# Altium schematic sheet Pi_Power.SchDoc: =DocumentName
size B; DrawnBy: Cary Smith; Organization: Las Cumbres Observatoy; Address1: 6740 Cortona Dr.; Address2: Suite 102; Address3: Goleta, CA 93117; DocumentNumber: 1; Revision: 1; SheetNumber: 1; SheetTotal: 1000's
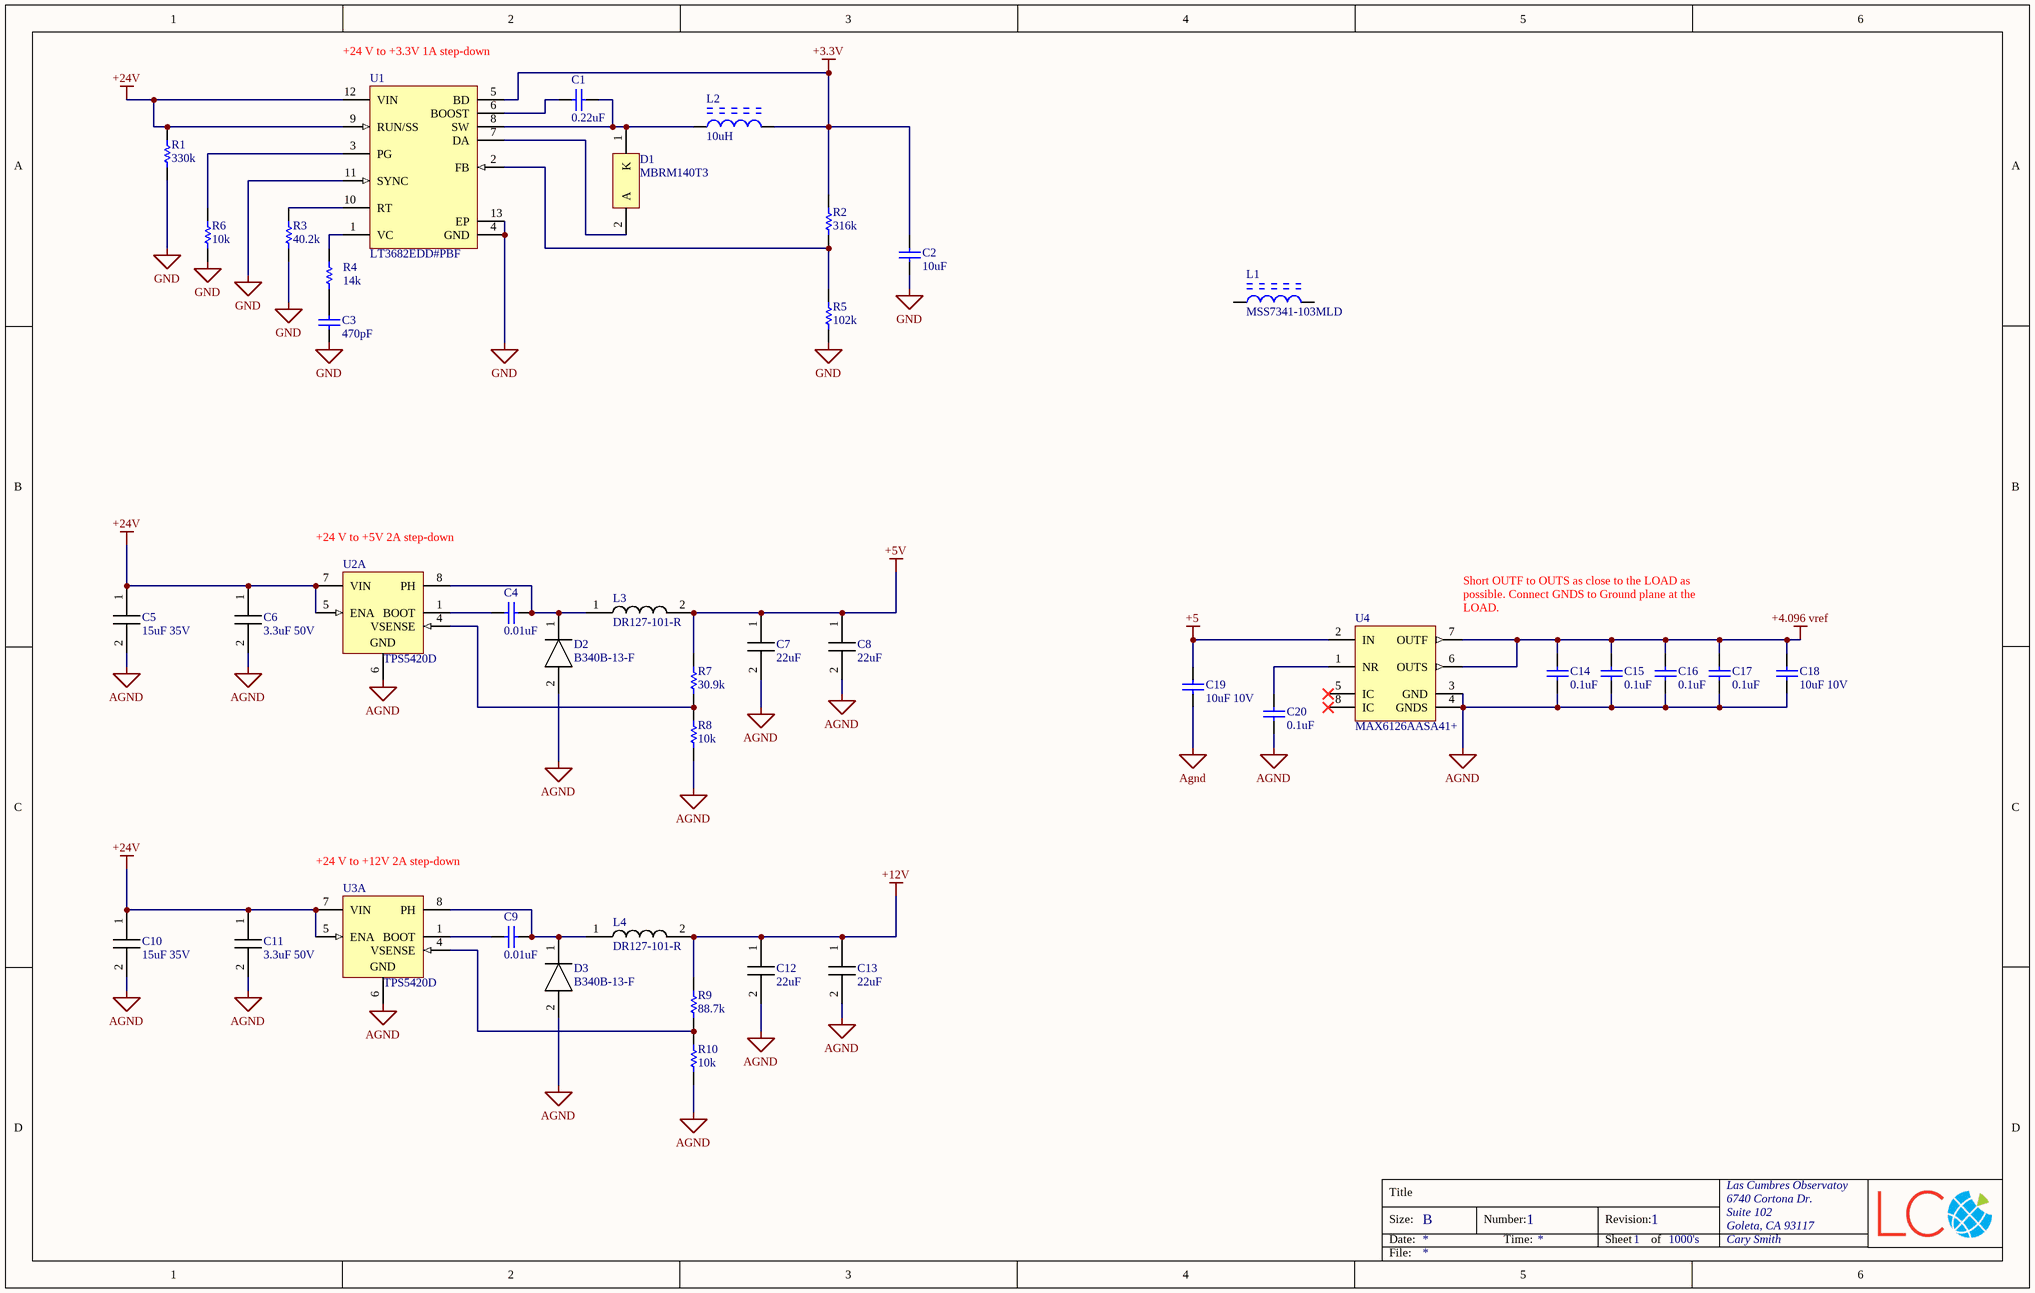
[diagram p0: Pi_Power.SchDoc]

## Parts
C1  0.22uF  [CAPC1608X90X35NL15T15]
C2  10uF  [CAPC2013X145X50NL20T25]
C3  470pF  [CAPC1005X55X25ML05T10]
C4  0.01uF  [CAPC1608X90X35LL15T15]
C5  15uF 35V  [CAPPM7343X310N]
C6  3.3uF 50V  [CAPC3225X230N]
C7  22uF  [CAPC3216X180N]
C8  22uF  [CAPC3216X180N]
C9  0.01uF  [CAPC1608X90X35LL15T15]
C10  15uF 35V  [CAPPM7343X310N]
C11  3.3uF 50V  [CAPC3225X230N]
C12  22uF  [CAPC3216X180N]
C13  22uF  [CAPC3216X180N]
C14  0.1uF  [CAPC1005X55X25ML05T10]
C15  0.1uF  [CAPC1005X55X25ML05T10]
C16  0.1uF  [CAPC1005X55X25ML05T10]
C17  0.1uF  [CAPC1005X55X25ML05T10]
C18  10uF 10V  [CAPC1609X100X15LL20]
C19  10uF 10V  [CAPC1609X100X15LL20]
C20  0.1uF  [CAPC1005X55X25ML05T10]
D1  MBRM140T3  [ONSC-POWERMITE-2-457-04_D_V]
D2  B340B-13-F  [DIOM5336X250N]
D3  B340B-13-F  [DIOM5336X250N]
L1  MSS7341-103MLD  [COIL-MSS7341_V]
L2  10uH  [COIL-MSS7341_V]
L3  DR127-101-R  [INDM125125X800N]
L4  DR127-101-R  [INDM125125X800N]
R1  330k  [RESC1005X40X25ML05T05]
R2  316k  [RESC1005X40X25LL05T05]
R3  40.2k  [RESC1005X40X25NL05T05]
R4  14k  [RESC1005X40X25LL05T05]
R5  102k  [RESC1005X40X25ML05T05]
R6  10k  [RESC1005X40X25NL05T05]
R7  30.9k  [RESC1005X40X25NL05T05]
R8  10k  [RESC1005X40X25NL05T05]
R9  88.7k  [RESC1005X40X25NL05T05]
R10  10k  [RESC1005X40X25NL05T05]
U1  LT3682EDD#PBF  [LT-DD-12_V]
U2  TPS5420D  [D0008A_L]  (part A of 2)
U3  TPS5420D  [D0008A_L]  (part A of 2)
U4  MAX6126AASA41+  [MAXM-S8+4_M]

## Nets
+3.3V: C2.2 L2.2 R2.2 U1.5(BD)
+4.096 vref: C14.2 C15.2 C16.2 C17.2 C18.2 U4.6(OUTS) U4.7(OUTF)
+5: C19.2 U4.2(IN)
+5V: C7.1 C8.1 L3.2 R7.2
+12V: C12.1 C13.1 L4.2 R9.2
+24V: C5.1(+) C6.1 C10.1(+) C11.1 R1.2 U1.9(RUN/SS) U1.12(VIN) U2.5(ENA) U2.7(VIN) U3.5(ENA) U3.7(VIN)
AGND: C5.2(-) C6.2 C7.2 C8.2 C10.2(-) C11.2 C12.2 C13.2 C14.1 C15.1 C16.1 C17.1 C18.1 C19.1 C20.1 D2.2(A) D3.2(A) R8.1 R10.1 U2.6(GND) U3.6(GND) U4.3(GND) U4.4(GNDS)
GND: C2.1 C3.1 R1.1 R3.1 R5.1 R6.1 U1.4(GND) U1.11(SYNC) U1.13(EP)
NetC1_1: C1.1 D1.1(K) L2.1 U1.8(SW)
NetC1_2: C1.2 U1.6(BOOST)
NetC3_2: C3.2 R4.1
NetC4_1: C4.1 U2.1(BOOT)
NetC4_2: C4.2 D2.1(K) L3.1 U2.8(PH)
NetC9_1: C9.1 U3.1(BOOT)
NetC9_2: C9.2 D3.1(K) L4.1 U3.8(PH)
NetC20_2: C20.2 U4.1(NR)
NetD1_2: D1.2(A) U1.7(DA)
NetR2_1: R2.1 R5.2 U1.2(FB)
NetR3_2: R3.2 U1.10(RT)
NetR4_2: R4.2 U1.1(VC)
NetR6_2: R6.2 U1.3(PG)
NetR7_1: R7.1 R8.2 U2.4(VSENSE)
NetR9_1: R9.1 R10.2 U3.4(VSENSE)

Not connected (* = marked no-connect by the designer): L1 1 2; U4 5(IC)* 8(IC)*

## Notes on the sheet
- (near U1) +24 V to +3.3V 1A step-down
- (near U2) +24 V to +5V 2A step-down
- Short OUTF to OUTS as close to the LOAD as possible. Connect GNDS to Ground plane at the LOAD.
- (near U3) +24 V to +12V 2A step-down
- Title
- Size:
- Date:
- B
- Number:
- Time:
- Revision:
- Sheet
- of
- File:

## Library data of the parts
C1 = CMP-2006-04195-1: 06033D224KAT2A; Manufacturer: AVX Interconnect / Elco; Part Number: 06033D224KAT2A
C2 = CMP-2007-01019-1: C0805C106M8PACTU; Manufacturer: Kemet; Part Number: C0805C106M8PACTU
C3 = CMP-2008-04369-1: GRM1555C1H471JA01D; Manufacturer: Murata; Part Number: GRM1555C1H471JA01D
C4 C9 = CMP-2006-04374-1: 06035C-103KAT2A; Manufacturer: AVX Interconnect / Elco; Part Number: 06035C-103KAT2A
C5 C10 = 293D156X9035D2TE3: Capacitor 293D156X9035D2TE3; Manufacturer_Name: Vishay; Allied_Number: 70398878; Datasheet Link: http://www.vishay.com/docs/40002/293d.pdf; Height: 3.1mm; Manufacturer_Part_Number: 293D156X9035D2TE3; Mouser Part Number: 74-293D156X9035D2TE3; Mouser Price/Stock: https://www.mouser.com/Search/Refine.aspx?Keyword=74-293D156X9035D2TE3; RS Part Number: 6843960; RS Price/Stock: http://uk.rs-online.com/web/p/tantalum-capacitors/6843960/?source=DS; Allied Price/Stock: https://www.alliedelec.com/vishay-dale-293d156x9035d2te3/70398878/
C6 C11 = C3225X7R1H335M250AB: Capacitor C3225X7R1H335M250AB; Manufacturer_Name: TDK; Datasheet Link: https://product.tdk.com/info/en/catalog/datasheets/mlcc_commercial_midvoltage_en.pdf; Height: 2.3mm; Manufacturer_Part_Number: C3225X7R1H335M250AB; RS Part Number: 9163037P; RS Price/Stock: http://uk.rs-online.com/web/p/products/9163037P
C7 C8 C12 C13 = C3216X6S1C226M160AC: Capacitor C3216X6S1C226M160AC; Manufacturer_Name: TDK; Datasheet Link: https://product.tdk.com/info/en/catalog/datasheets/mlcc_commercial_midvoltage_en.pdf; Height: 1.8mm; Manufacturer_Part_Number: C3216X6S1C226M160AC
C14-C17 C20 = CMP-2008-02013-1: VJ0402G104KXQCW1BC; Manufacturer: Vitramon; Part Number: VJ0402G104KXQCW1BC
C18 C19 = CMP-2006-00193-1: TACL106M010XTA; Manufacturer: AVX Interconnect / Elco; Part Number: TACL106M010XTA
D1 = CMP-1055-00287-1: Schottky Power Rectifier, 2-Pin Powermite, Tape and Reel; Manufacturer: On Semiconductor; Configuration: Single; IFSM Max (A): 50; ComponentLink3Description: Package Specification; Packing: Tape and Reel; RoHS: FALSE; ComponentLink1Description: Manufacturer URL; ComponentLink2URL: http://www.onsemi.cn/pub/Collateral/MBRM140-D.PDF; DatasheetVersion: Rev. 4; PartNumber: MBRM140T3; ComponentLink1URL: http://www.onsemi.com/; ComponentLink3URL: http://www.onsemi.com/pub_link/Collateral/457-04.PDF; PackageVersion: Rev. F, 05/2013; PackageDescription: 2-Pin POWERMITE, Body 1.965 x 1.9 mm; Mounting Technology: Surface Mount; ComponentLink2Description: Datasheet; PackageReference: POWERMITE-2-457-04
D2 D3 = B340B-13-F: Diode; Manufacturer_Name: Diodes Inc.; Datasheet Link: https://componentsearchengine.com/Datasheets/2/B340B-13-F.pdf; Height: 2.5mm; Manufacturer_Part_Number: B340B-13-F; Mouser Part Number: 621-B340B-F; Mouser Price/Stock: https://www.mouser.com/Search/Refine.aspx?Keyword=621-B340B-F; RS Part Number: 9228119; RS Price/Stock: http://uk.rs-online.com/web/p/products/9228119
L1 = CMP-2000-06766-1: Shielded Power Inductor, 10 uH, +/- 20%, 3.8 A, 2-Pin SMD, RoHS, Tape and Reel; Manufacturer: Coilcraft; Maximum DC Current: 3.8A; Test Frequency: 100kHz; Self Resonant Frequency: 32MHz; Maximum DC Resistance: 38mOhms; Core Material: Ferrite; Inductance: 10uH; Manufacturer URL: http://www.coilcraft.com/; Length: 7.3mm; Series: MSS7341; Product Category: FixedInductors; Product: PowerInductors; Datasheet URL: http://www.coilcraft.com/pdfs/MSS7341.pdf; Termination Style: SMD/SMT; Tolerance: 20%; RoHS: True; Width: 7.3mm; Package Reference: MSS7341; Datasheet Version: 12/2015; Operating Temperature Range: -40Cto+85C; Height: 4.1mm; Mounting Style: SMD/SMT; Mounting Technology: SurfaceMount; Shielding: Shielded; Brand: Coilcraft; Package Description: 2-Pin Surface Mounted Device , Body 6.6 x 6.6 mm; Packaging: Reel
L2 = CMP-2000-06766-1: Shielded Power Inductor, 10 uH, +/- 20%, 3.8 A, 2-Pin SMD, RoHS, Tape and Reel MSS7341-103MLD; Manufacturer: Coilcraft; Maximum DC Current: 3.8A; Test Frequency: 100kHz; Self Resonant Frequency: 32MHz; Maximum DC Resistance: 38mOhms; Core Material: Ferrite; Manufacturer URL: http://www.coilcraft.com/; Length: 7.3mm; Series: MSS7341; Product Category: FixedInductors; Product: PowerInductors; Datasheet URL: http://www.coilcraft.com/pdfs/MSS7341.pdf; Termination Style: SMD/SMT; Tolerance: 20%; RoHS: True; Width: 7.3mm; Package Reference: MSS7341; Datasheet Version: 12/2015; Operating Temperature Range: -40Cto+85C; Height: 4.1mm; Mounting Style: SMD/SMT; Mounting Technology: SurfaceMount; Shielding: Shielded; Brand: Coilcraft; Package Description: 2-Pin Surface Mounted Device , Body 6.6 x 6.6 mm; Packaging: Reel; Inductance: 10uH
L3 L4 = DR127-101-R: Inductor; Manufacturer_Name: COILTRONICS; Allied_Number: 70037928; Manufacturer_Part_Number: DR127-101-R; Mouser Part Number: 704-DR127-101-R; Mouser Price/Stock: http://www.mouser.com/Search/ProductDetail.aspx?qs=yzwxPInThYS5S9GNGzgpHA%3d%3d; RS Part Number: 704-DR127-101-R; RS Price/Stock: http://www.mouser.com/Search/ProductDetail.aspx?qs=yzwxPInThYS5S9GNGzgpHA%3d%3d; Allied Price/Stock: https://www.alliedelec.com/coiltronics-dr127-101-r/70037928/
R1 = CMP-2002-08524-1: CRCW0402330RJNED; Manufacturer: Vishay Dale; Part Number: CRCW0402330RJNED
R2 = CMP-2002-08513-1: CRCW0402316KFKED; Manufacturer: Vishay Dale; Part Number: CRCW0402316KFKED
R3 = CMP-2002-08617-1: CRCW040240K2FKED; Manufacturer: Vishay Dale; Part Number: CRCW040240K2FKED
R4 = CMP-2002-08207-1: CRCW040214K0FKED; Manufacturer: Vishay Dale; Part Number: CRCW040214K0FKED
R5 = CMP-2002-08130-1: CRCW0402102KFKED; Manufacturer: Vishay Dale; Part Number: CRCW0402102KFKED
R6 R8 R10 = CMP-2002-08135-1: CRCW040210K0FKED; Manufacturer: Vishay Dale; Part Number: CRCW040210K0FKED
R7 = CMP-2002-00859-1: ERJ-2RKF30R9X; Manufacturer: Panasonic; Part Number: ERJ-2RKF30R9X
R9 = CMP-2002-00251-1: CRCW040288K7FKED; Manufacturer: Vishay Dale; Part Number: CRCW040288K7FKED
U1 = CMP-0491-00244-1: 1 A Micropower Step-Down Switching Regulator, 12-pin SON (DD-12), -40 to 125 degC, Pb-Free; Manufacturer: Linear Technology; Number of Outputs: 1; Over Voltage Protection(V): 60; Frequency Adjust Range: 250kHz - 2.2MHz; RoHS: TRUE; PackageDescription: 12-Pin Plastic DFN, Body 3 x 3 mm, Pitch 0.45 mm; PackageReference: DD-12; PartNumber: LT3682EDD#PBF; ComponentLink1URL: http://www.linear.com/; ComponentLink3URL: http://cds.linear.com/docs/en/packaging/DFN_12_05-08-1725.pdf; Mounting Technology: Surface Mount; ComponentLink1Description: Manufacturer URL; ComponentLink3Description: Package Specification; PackageVersion: Rev. A, 06/2010; ComponentLink2Description: Datasheet; ComponentLink2URL: http://cds.linear.com/docs/en/datasheet/3682f.pdf
U2 U3 = CMP-0323-00173-3: Buck Step Down Regulator with 5.5 to 36 V Input and 1.23 to 31 V Output, -40 to 125 degC, 8-Pin SOIC (D), Green (RoHS & no Sb/Br); Manufacturer: Texas Instruments; Vin(Max)(V): 36; Duty Cycle(Max)(%): 87; Vout(Max)(V): 31; Vout(Min)(V): 1.23; Switch Current Limit(Typ)(A): 3; Vin(Min)(V): 5.5; Regulated Outputs(#): 1; Rating: Catalog; Iout(Max)(A): 2; SubFamily: Step-Down Regulator; Code_JEDEC: MS-012AA; Topology: Buck; PackageDescription: 8-Pin Plastic Small Outline Integrated Circuit, 4.9 x 3.9 mm, Pitch 1.27 mm Pitch; PackageVersion: revM, Jun-2011; ComponentLink2Description: Package Specification; ComponentLink1URL: http://www.ti.com/general/docs/lit/getliterature.tsp?genericPartNumber=TPS5420&fileType=pdf; Mounting Technology: Surface Mount; ComponentLink3Description: URL Link1; PackageReference: D0008A; ComponentLink1Description: Datasheet; ComponentLink3URL: Samples URL:http://www.ti.com/product/tps5420#samples; Eco-Plan: Green (RoHS & no Sb/Br); ComponentLink2URL: http://www.ti.com/litv/pdf/msoi002j; DatasheetVersion: SLVS642C; Iq(Typ)(mA): 3; PartNumber: TPS5420D
U4 = CMP-0977-00016-1: Ultra-High-Precision, Ultra-Low-Noise, Series Voltage Reference, 4.096 V, -40 to 125 degC, 8-Pin SOIC (S8+4), RoHS, Tube; Manufacturer: Maxim; Output Voltage Accuracy: 0.02% Max.; Line Regulation: 60 uV/V Max.; VOUT: 4.096 V; Dropout Voltage@10 mA: 0.1 V Typ.; VIN: 4.3 to 12.6 V; Operating Temperature: -40 to 125 degC; ComponentLink3URL: http://pdfserv.maximintegrated.com/package_dwgs/21-0041.PDF; PartNumber: MAX6126AASA41+; RoHS: TRUE; ComponentLink3Description: Package Specification; ComponentLink1URL: http://www.maximintegrated.com/; Mounting Technology: Surface Mount; Packing: Tube; DatasheetVersion: Rev. 6; ComponentLink1Description: Manufacturer URL; ComponentLink2URL: http://datasheets.maximintegrated.com/en/ds/MAX6126.pdf; PackageDescription: 8-Pin Small Outline Integrated Circuit Package, Body 4.9 x 3.9 mm, Pitch 1.27 mm; ComponentLink2Description: Datasheet; PackageVersion: Rev. E